# EAGLE schematic schematic (EAGLE 9.5.2)
CNAME: Devansh Srivastava
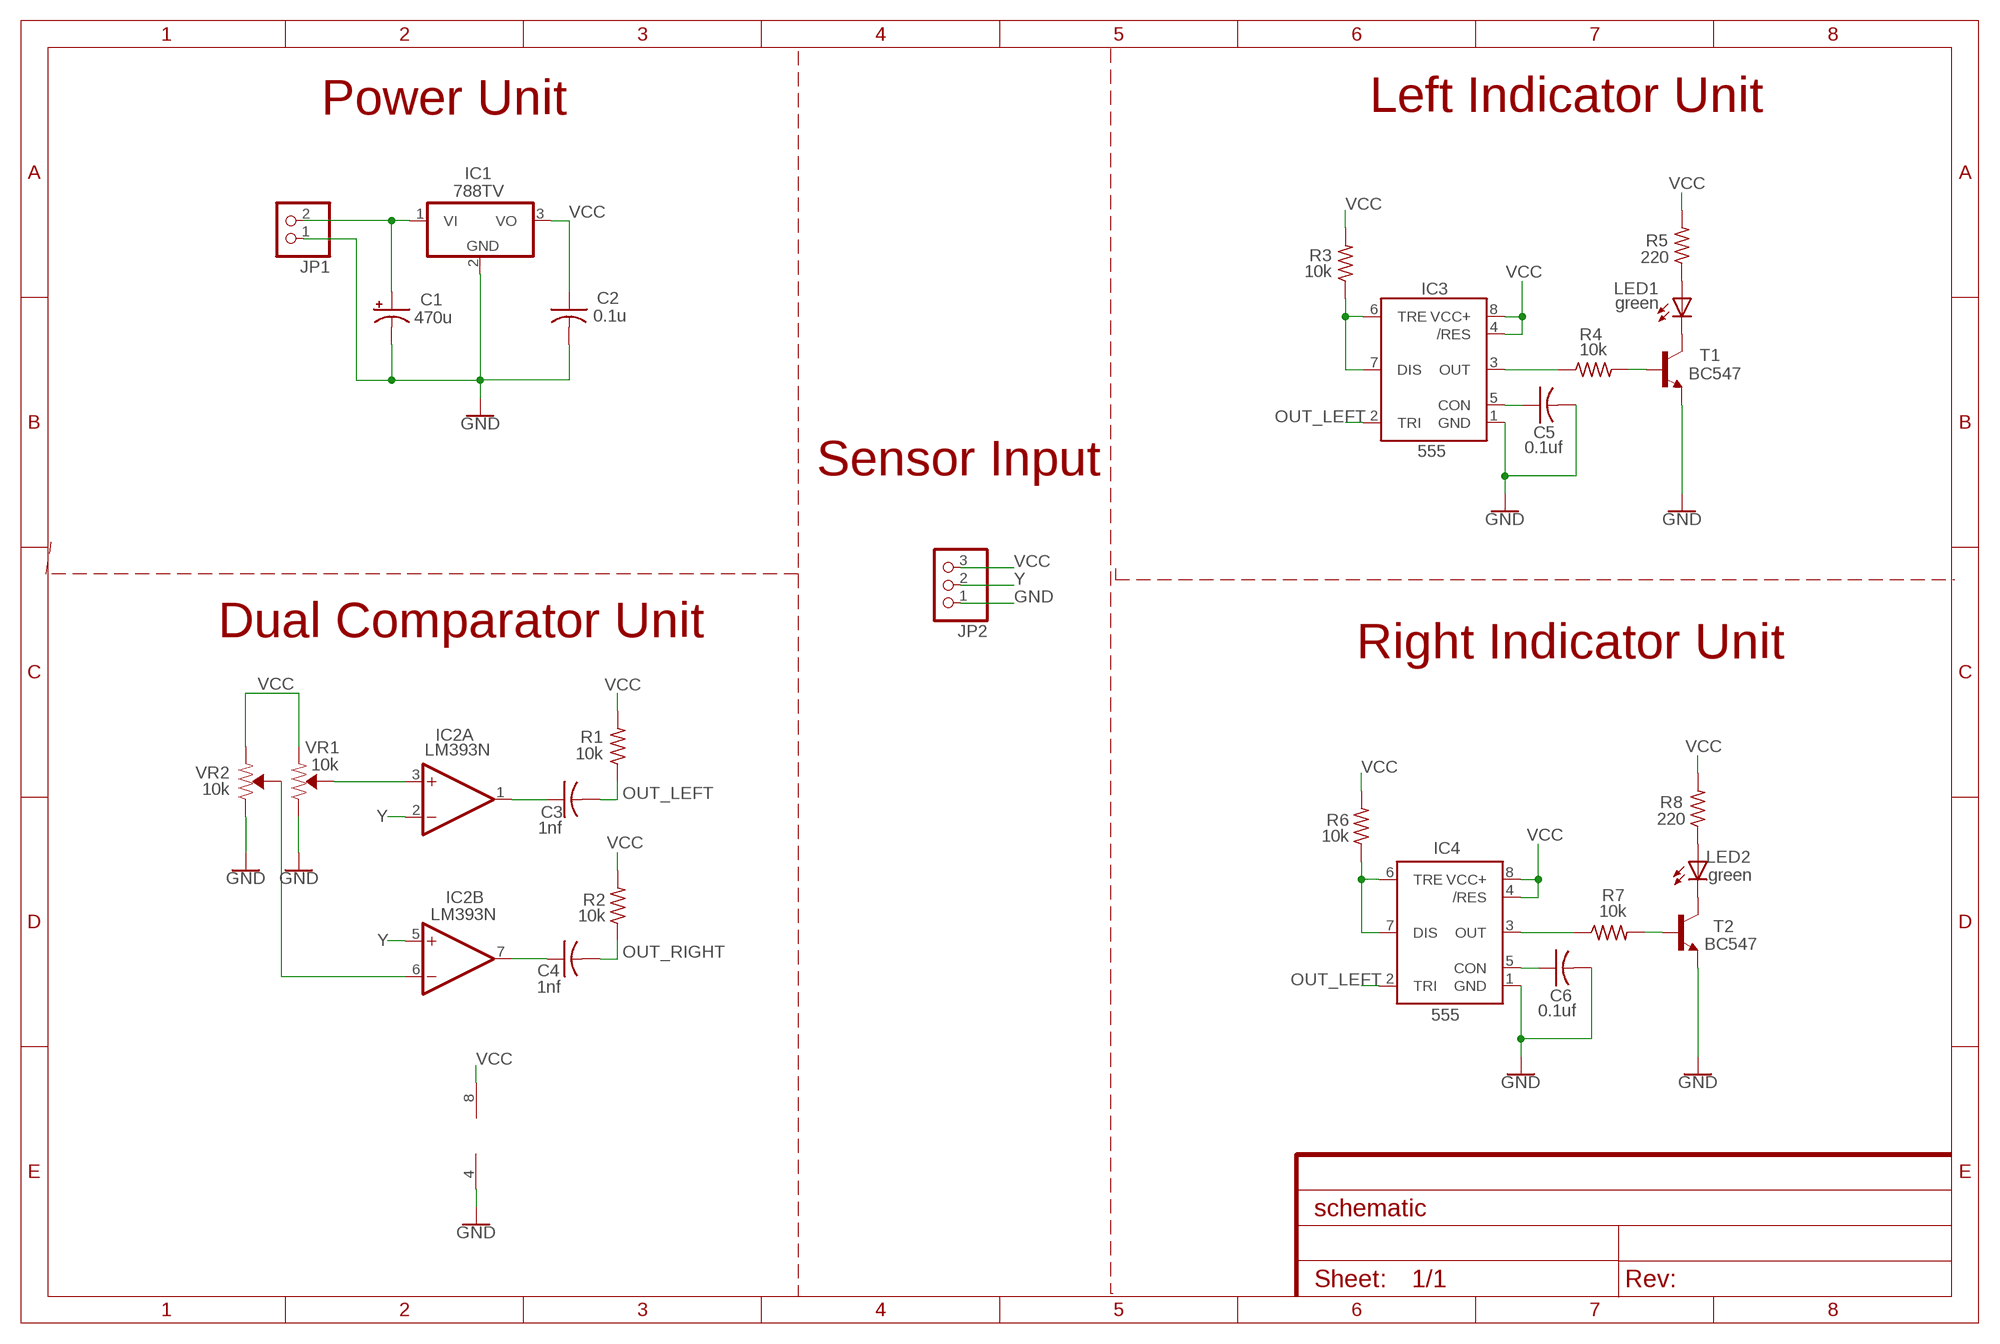
[diagram p0: schematic, sheet 1]

## Parts
C1  470u  CPOL-USE2-4  [E2-4]
C2  0.1u  C-US025-025X050  [C025-025X050]
C3  1nf  C-US025-025X050  [C025-025X050]
C4  1nf  C-US025-025X050  [C025-025X050]
C5  0.1uf  C-US025-025X050  [C025-025X050]
C6  0.1uf  C-US025-025X050  [C025-025X050]
IC1  788TV  [TO220V]
IC2  LM393N  [DIL08]
IC3  555  555KIT  [DIP08-KIT]
IC4  555  555KIT  [DIP08-KIT]
JP1  PINHD-1X2  [1X02]
JP2  PINHD-1X3  [1X03]
LED1  green  LED5MM  [LED5MM]
LED2  green  LED5MM  [LED5MM]
R1  10k  R-US_0204/5  [0204/5]
R2  10k  R-US_0204/5  [0204/5]
R3  10k  R-US_0204/5  [0204/5]
R4  10k  R-US_0204/5  [0204/5]
R5  220  R-US_0204/5  [0204/5]
R6  10k  R-US_0204/5  [0204/5]
R7  10k  R-US_0204/5  [0204/5]
R8  220  R-US_0204/5  [0204/5]
T1  BC547  [TO92]
T2  BC547  [TO92]
VR1  10k  TRIMPOT-PTH-10MM-KNOB-1/2W-10%  [TRIMPOT-PTH-3386U]
VR2  10k  TRIMPOT-PTH-10MM-KNOB-1/2W-10%  [TRIMPOT-PTH-3386U]

## Nets
GND: C1.- C2.2 C5.2 C6.2 IC1.2(GND) IC2.4(P:V-) IC3.1(GND) IC4.1(GND) JP1.1 JP2.1 T1.1(E) T2.1(E) VR1.3(CW) VR2.3(CW)
N$1: C1.+ IC1.1(VI) JP1.2
N$2: IC2.3(A:+IN) VR1.2(WIPER)
N$3: IC2.6(B:-IN) VR2.2(WIPER)
N$4: C3.1 IC2.1(A:OUT)
N$5: C4.1 IC2.7(B:OUT)
N$6: C5.1 IC3.5(CON)
N$7: IC3.6(TRE) IC3.7(DIS) R3.1
N$8: IC3.3(OUT) R4.1
N$9: R4.2 T1.2(B)
N$10: LED1.K(C) T1.3(C)
N$11: LED1.A R5.1
N$12: C6.1 IC4.5(CON)
N$13: IC4.6(TRE) IC4.7(DIS) R6.1
N$14: IC4.3(OUT) R7.1
N$15: R7.2 T2.2(B)
N$16: LED2.K(C) T2.3(C)
N$17: LED2.A R8.1
OUT_LEFT: C3.2 IC3.2(TRI) IC4.2(TRI) R1.1
OUT_RIGHT: C4.2 R2.1
VCC: C2.1 IC1.3(VO) IC2.8(P:V+) IC3.4(/RES) IC3.8(VCC+) IC4.4(/RES) IC4.8(VCC+) JP2.3 R1.2 R2.2 R3.2 R5.2 R6.2 R8.2 VR1.1(CCW) VR2.1(CCW)
Y: IC2.2(A:-IN) IC2.5(B:+IN) JP2.2

## Notes on the sheet
- Power Unit | Left Indicator Unit
- Sensor Input
- Dual Comparator Unit
- Right Indicator Unit

## Library data of the parts
C1 = adafruit:CPOL-US: POLARIZED CAPACITOR, American symbol
C2-C6 = adafruit:C-US: CAPACITOR, American symbol
IC1 = linear:78*: Positive VOLTAGE REGULATOR Source: http://cache.national.com/ds/LM/LM78L05.pdf http://www.fairchildsemi.com/ds/LM/LM7805.pdf
IC2 = linear:LM393: COMPARATOR
IC3 IC4 = SparkFun-IC-Special-Function:555: General purpose bipolar Timer Datasheet <http://www.sparkfun.com/datasheets/Components/General/ne555.pdf> SparkFun Products SparkFun SparkPunk Sequencer Kit <https://www.sparkfun.com/products/12707> (KIT-12707) Storefront Component: 555 Timer <https://www.sparkfun.com/products/9273> (COM-09273) Two parts valid for production: VFP: IC-11930 (M7555 PTH) VFP: IC-09173 (555 PTH) - Preferred; PROD_ID: IC-09173; PROD_ID_ALT: IC-11930
JP1 = pinhead:PINHD-1X2: PIN HEADER
JP2 = pinhead:PINHD-1X3: PIN HEADER
LED1 LED2 = adafruit:LED: LED OSRAM: - CHIPLED LG R971, LG N971, LY N971, LG Q971, LY Q971, LO R971, LY R971 LH N974, LH R974 LS Q976, LO Q976, LY Q976 LO Q996 - Hyper CHIPLED LW Q18S LB Q993, LB Q99A, LB R99A - SideLED LS A670, LO A670, LY A670, LG A670, LP A670 LB A673, LV A673, LT A673, LW A673 LH A674 LY A675 LS A676, LA A676, LO A676, LY A676, LW A676 LS A679, LY A679, LG A679 - Hyper Micro SIDELED® LS Y876, LA Y876, LO Y876, LY Y876 LT Y87S - SmartLED LW L88C, LW L88S LB L89C, LB L89S, LG L890 LS L89K, LO L89K, LY L89K LS L896, LA L896, LO L896, LY L896 - TOPLED LS T670, LO T670, LY T670, LG T670, LP T670 LSG T670, LSP T670, LSY T670, LOP T670, LYG T670 LG T671, LOG T671, LSG T671 LB T673, LV T673, LT T673, LW T673 LH T674 LS T676, LA T676, LO T676, LY T676, LB T676, LH T676, LSB T676, LW T676 LB T67C, LV T67C, LT T67C, LS T67K, LO T67K, LY T67K, LW E67C LS E67B, LA E67B, LO E67B, LY E67B, LB E67C, LV E67C, LT E67C LW T67C LS T679, LY T679, LG T679 LS T770, LO T770, LY T770, LG T770, LP T770 LB T773, LV T773, LT T773, LW T773 LH T774 LS E675, LA E675, LY E675, LS T675 LS T776, LA T776, LO T776, LY T776, LB T776 LHGB T686 LT T68C, LB T68C - Hyper Mini TOPLED® LB M676 - Mini TOPLED Santana® LG M470 LS M47K, LO M47K, LY M47K Source: http://www.osram.convergy.de/
R1-R8 = rcl:R-US_: RESISTOR, American symbol; SPICEPREFIX: R
T1 T2 = transistor:BC547: NPN TRANSISTOR
VR1 VR2 = SparkFun-Resistors:TRIMPOT: Trimming Potentiometer (Trimpot) Three-terminal potentiometers, with an adjustable wiper and two adjustable resistors. A pot can be used to create a configurable voltage divider, or as a variable resistor. "Trimpots" are a subset of potentiometers, usually intended for "set-and-forget" applications. They're often more delicate than standard potentiometers - rated for fewer turns. Variants PTH-KNOB - PTH Trimpot w/ finger-adjustable knob Trimpot 10K with Knob <https://www.sparkfun.com/products/9806> (COM-09806) Datasheet <http://www.sparkfun.com/datasheets/Components/General/TSR-3386.pdf> SMD-3MM-CLOSED-FRAME - SMD 3mm Square Closed-Frame Trimpot Used on e.g. EasyDriver - Stepper Motor Driver <https://www.sparkfun.com/products/12779> Datasheet <http://www.bitechnologies.com/pdfs/22.pdf> (22AR10KTR) SMD-5MM - SMD 5mm Square Closed-Frame Trimpot Used on e.g. IOIO-OTG - V2.2 <https://www.sparkfun.com/products/13613> Datasheet <http://www.vishay.com/docs/51008/ts53.pdf> (TS53YL502MR10) SMD-3MM-1/10W-25% - 3mm Square Open-Frame Trimpot Used on e.g. SparkFun Shapeoko <https://www.sparkfun.com/products/13899> Datasheet <http://www.bourns.com/docs/Product-Datasheets/TC33.pdf> (TC33X-2-103E); PROD_ID: RES-09730; SF_SKU: COM-09806